# Altium schematic sheet USB-C.SchDoc
size A3; SheetNumber: 4; SheetTotal: 5
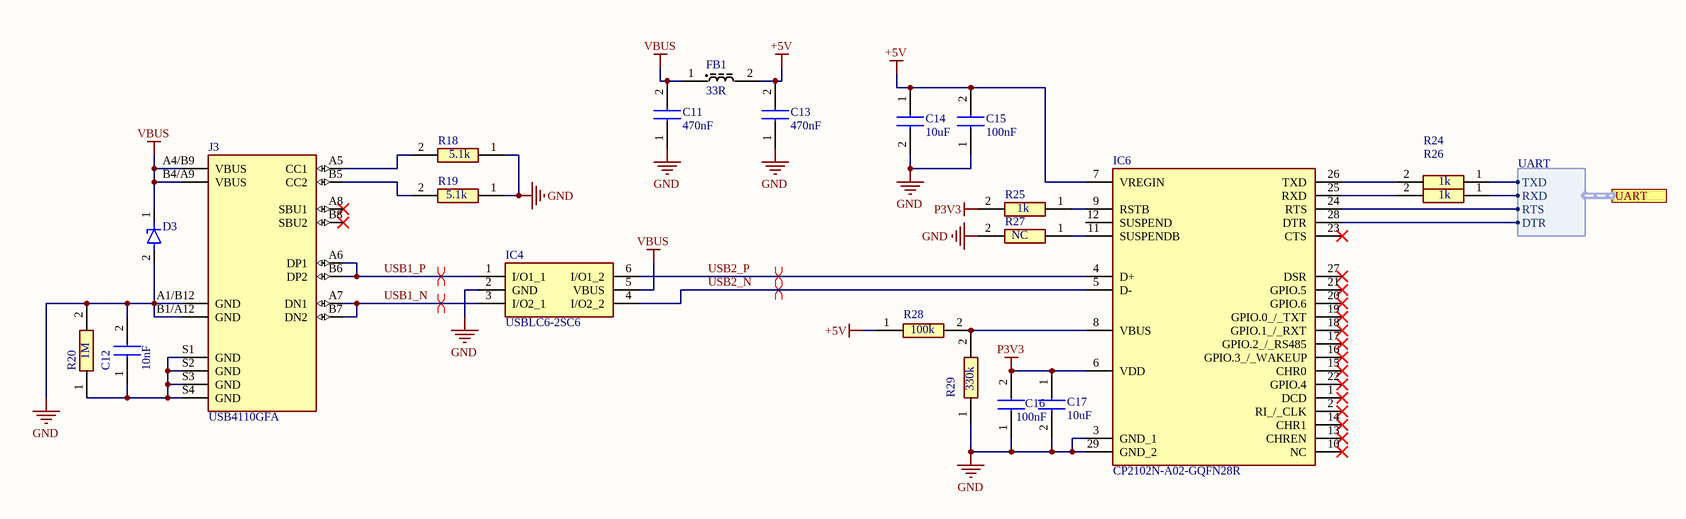
[diagram p0: USB-C.SchDoc]

## Parts
C11  470nF  [GRM15x]
C12  10nF  [GRM15x]
C13  470nF  [GRM15x]
C14  10uF  [GRM18x]
C15  100nF  [CAPC1005X70N]
C16  100nF  [CAPC1005X70N]
C17  10uF  [GRM18x]
D3  ESDA25P35-1U1M  [ESDA25P351U1M]  (value not drawn)
FB1  33R  [BLM18SP221SN1B]
IC4  USBLC6-2SC6  [SOT95P280X145-6N]
IC6  CP2102N-A02-GQFN28R  [QFN50P500X500X80-29N-D]
J3  USB4110GFA  [GCT_USB4110GFA]
R18  5.1k  [RESC1005X35N]
R19  5.1k  [RESC1005X35N]
R20  1M  [RESC1005X40N]
R24  1k  [RESC1005X35N]
R25  1k  [RESC1005X35N]
R26  1k  [RESC1005X35N]
R27  NC  [RESC1005X35N]
R28  100k  [RESC1005X40N]
R29  330k  [RESC1005X40N]

## Ports
UART (harness UART, see main[3B], ESP32C6[3B])

## Harnesses
UART: TXD, RXD, RTS, DTR

## Nets
+5V: C13.2 C14.1 C15.2 FB1.2 IC6.7(VREGIN) R28.1
GND: C11.1 C12.2 C13.1 C14.2 C15.1 C16.1 C17.2 D3.2(A) IC4.2(GND) IC6.3(GND_1) IC6.29(GND_2) J3.A1/B12(GND) J3.B1/A12(GND) R18.1 R19.1 R20.2 R27.2 R29.1
P3V3: C16.2 C17.1 IC6.6(VDD) R25.2
VBUS: C11.2 D3.1(K) FB1.1 IC4.5(VBUS) J3.A4/B9(VBUS) J3.B4/A9(VBUS)
USB1_N: IC4.3(I/O2_1) J3.A7(DN1) J3.B7(DN2)
USB1_P: IC4.1(I/O1_1) J3.A6(DP1) J3.B6(DP2)
USB2_N: IC4.4(I/O2_2) IC6.5(D-)
USB2_P: IC4.6(I/O1_2) IC6.4(D+)
NetC12_1: C12.1 J3.S1(GND) J3.S2(GND) J3.S3(GND) J3.S4(GND) R20.1
NetIC6_8: IC6.8(VBUS) R28.2 R29.2
NetIC6_9: IC6.9(RSTB) R25.1
NetIC6_11: IC6.11(SUSPENDB) R27.1
NetIC6_24: IC6.24(RTS) ; port UART.RTS
NetIC6_25: IC6.25(RXD) R26.2
NetIC6_26: IC6.26(TXD) R24.2
NetIC6_28: IC6.28(DTR) ; port UART.DTR
NetJ3_A5: J3.A5(CC1) R18.2
NetJ3_B5: J3.B5(CC2) R19.2
NetR24_1: R24.1 ; port UART.TXD
NetR26_1: R26.1 ; port UART.RXD

Not connected (* = marked no-connect by the designer): IC6 1(DCD)* 2(RI_/_CLK)* 10(NC)* 12(SUSPEND) 13(CHREN)* 14(CHR1)* 15(CHR0)* 16(GPIO.3_/_WAKEUP)* 17(GPIO.2_/_RS485)* 18(GPIO.1_/_RXT)* 19(GPIO.0_/_TXT)* 20(GPIO.6)* 21(GPIO.5)* 22(GPIO.4)* 23(CTS)* 27(DSR)*; J3 A8(SBU1)* B8(SBU2)*

## Layout directives
differential pair; differential pair class USB; net class USB: USB1_N, USB1_P, USB2_N, USB2_P

## Notes on the sheet
- Title:
- Date:
- Project:
- Type:
- Schematic
- Variant:
- Revision:
- Sheet
- of
- Author:
- Evžen Šteif
- Size:
- A4

## Library data of the parts
C11 C13 = GRM155R61H474KE11J: Capacitor; Manufacturer_Name: Murata Electronics; Datasheet Link: https://search.murata.co.jp/Ceramy/image/img/A01X/G101/ENG/GRM155R61H474KE11-01A.pdf; Height: 0.33mm; Manufacturer_Part_Number: GRM155R61H474KE11J; Mouser Part Number: 81-GRM155R61H474KE1J; Mouser Price/Stock: https://www.mouser.co.uk/ProductDetail/Murata-Electronics/GRM155R61H474KE11J?qs=lEfY3O89AqlWLR2W%252BlOiGQ%3D%3D
C12 = GRM155R71H103KA88D: Capacitor; Manufacturer_Name: Murata Electronics; Datasheet Link: https://search.murata.co.jp/Ceramy/image/img/A01X/G101/ENG/GRM155R71H103KA88-01A.pdf; Height: 0.33mm; Manufacturer_Part_Number: GRM155R71H103KA88D; Mouser Part Number: 81-GRM155R71H103KA8D; Mouser Price/Stock: https://www.mouser.co.uk/ProductDetail/Murata-Electronics/GRM155R71H103KA88D?qs=Dfh4SrgScWxOVlCuzd3ZyQ%3D%3D; Arrow Part Number: GRM155R71H103KA88D; Arrow Price/Stock: https://www.arrow.com/en/products/grm155r71h103ka88d/murata-manufacturing?utm_currency=USD&region=nac
C14 C17 = GRM188R61E106KA73D: Capacitor; Manufacturer_Name: Murata Electronics; Datasheet Link: https://search.murata.co.jp/Ceramy/image/img/A01X/G101/ENG/GRM188R61E106KA73-01A.pdf; Height: 0.9mm; Manufacturer_Part_Number: GRM188R61E106KA73D; Mouser Part Number: 81-GRM188R61E106KA3D; Mouser Price/Stock: https://www.mouser.co.uk/ProductDetail/Murata-Electronics/GRM188R61E106KA73D?qs=5aG0NVq1C4z8ebxPkQZf9A%3D%3D; Arrow Part Number: GRM188R61E106KA73D; Arrow Price/Stock: https://www.arrow.com/en/products/grm188r61e106ka73d/murata-manufacturing?region=nac
C15 C16 = GRM155R61A104KA01D: Capacitor; Manufacturer_Name: Murata Electronics; Datasheet Link: https://search.murata.co.jp/Ceramy/image/img/A01X/G101/ENG/GRM155R61A104KA01-02A.pdf; Height: 0.7mm; Manufacturer_Part_Number: GRM155R61A104KA01D; Mouser Part Number: 81-GRM155R61A104KA01; Mouser Price/Stock: https://www.mouser.co.uk/ProductDetail/Murata-Electronics/GRM155R61A104KA01D?qs=5bAuhL3RhmNZw0v59AqOJA%3D%3D; Arrow Part Number: GRM155R61A104KA01D; Arrow Price/Stock: https://www.arrow.com/en/products/grm155r61a104ka01d/murata-manufacturing?utm_currency=USD&region=europe
D3 = ESDA25P35-1U1M: TVS Diode (Uni-directional); Manufacturer_Name: STMicroelectronics; Datasheet Link: https://www.st.com/resource/en/datasheet/esda25p35-1u1m.pdf; Height: 0.6mm; Manufacturer_Part_Number: ESDA25P35-1U1M; Mouser Part Number: 511-ESDA25P35-1U1M; Mouser Price/Stock: https://www.mouser.co.uk/ProductDetail/STMicroelectronics/ESDA25P35-1U1M?qs=aVyJF2WnouQUWqgNP85ZrA%3D%3D; Arrow Part Number: ESDA25P35-1U1M; Arrow Price/Stock: https://www.arrow.com/en/products/esda25p35-1u1m/stmicroelectronics?utm_currency=USD&region=europe
FB1 = BLM18SG330SN1D: Ferrite Bead; Manufacturer_Name: Murata Electronics; Datasheet Link: http://www.murata.com/~/media/webrenewal/support/library/catalog/products/emc/emifil/c31e.ashx?la=en-gb; Height: 0.95mm; Manufacturer_Part_Number: BLM18SG330SN1D; Mouser Part Number: 81-BLM18SG330SN1D; Mouser Price/Stock: https://www.mouser.co.uk/ProductDetail/Murata-Electronics/BLM18SG330SN1D?qs=7EBvPakHacUT88safgvlfQ%3D%3D; Arrow Part Number: BLM18SG330SN1D; Arrow Price/Stock: https://www.arrow.com/en/products/blm18sg330sn1d/murata-manufacturing
IC4 = USBLC6-2SC6: Integrated Circuit; Manufacturer_Name: STMicroelectronics; Datasheet Link: http://www.st.com/st-web-ui/static/active/en/resource/technical/document/datasheet/CD00050750.pdf; Height: 1.45mm; Manufacturer_Part_Number: USBLC6-2SC6; Mouser Part Number: 511-USBLC6-2SC6; Mouser Price/Stock: https://www.mouser.co.uk/ProductDetail/STMicroelectronics/USBLC6-2SC6?qs=po45yt2pPpu%2FhNIlwQdTlg%3D%3D; Arrow Part Number: USBLC6-2SC6; Arrow Price/Stock: https://www.arrow.com/en/products/usblc6-2sc6/stmicroelectronics?utm_currency=USD&region=europe
IC6 = CP2102N-A02-GQFN28R: Integrated Circuit; Manufacturer_Name: Silicon Labs; Datasheet Link: https://www.silabs.com/documents/public/data-sheets/cp2102n-datasheet.pdf; Height: 0.8mm; Manufacturer_Part_Number: CP2102N-A02-GQFN28R; Mouser Part Number: 634-CP2102NA02QFN28R; Mouser Price/Stock: https://www.mouser.co.uk/ProductDetail/Silicon-Labs/CP2102N-A02-GQFN28R?qs=u16ybLDytRag4qKvSH3fTw%3D%3D; Arrow Part Number: CP2102N-A02-GQFN28R; Arrow Price/Stock: https://www.arrow.com/en/products/cp2102n-a02-gqfn28r/silicon-labs?utm_currency=USD&region=nac
J3 = USB4110GFA: USB-C (USB TYPE-C) USB 2.0 Receptacle Connector 24 (16+8 Dummy) Position Surface Mount, Right Angle; MF: Global Connector Technology; SnapEDA_Link: https://www.snapeda.com/parts/USB4110GFA/Global+Connector+Technology/view-part/?ref=snap; Package: None; Value: *; MP: USB4110GFA; Check_prices: https://www.snapeda.com/parts/USB4110GFA/Global+Connector+Technology/view-part/?ref=eda
R18 R19 = RT0402FRE075K1L: Resistor; Manufacturer_Name: YAGEO; Datasheet Link: https://www.yageo.com/upload/media/product/app/datasheet/rchip/pyu-rt_1-to-0.01_rohs_l.pdf; Height: 0.35mm; Manufacturer_Part_Number: RT0402FRE075K1L; Mouser Part Number: RT0402FRE075K1L; Mouser Price/Stock: https://www.mouser.co.uk/ProductDetail/YAGEO/RT0402FRE07100RL?qs=BXCcY9r%252B08AcvLZjF7vcwQ%3D%3D
R20 = RC0402FR-071ML: Resistor; Manufacturer_Name: YAGEO; Datasheet Link: https://componentsearchengine.com/Datasheets/2/RC0402FR-071ML.pdf; Height: 0.4mm; Manufacturer_Part_Number: RC0402FR-071ML; Mouser Part Number: 603-RC0402FR-071ML; Mouser Price/Stock: https://www.mouser.co.uk/ProductDetail/YAGEO/RC0402FR-071ML?qs=V1yeUXFNrknfoI4987wfBQ%3D%3D; Arrow Part Number: RC0402FR-071ML; Arrow Price/Stock: https://www.arrow.com/en/products/rc0402fr-071ml/yageo?region=nac
R24-R26 = RT0402FRE071KL: Resistor; Manufacturer_Name: KEMET; Datasheet Link: https://www.yageo.com/upload/media/product/productsearch/datasheet/rchip/PYu-RT_1-to-0.01_RoHS_L_11.pdf; Height: 0.35mm; Manufacturer_Part_Number: RT0402FRE071KL; Mouser Part Number: RT0402FRE071KL; Mouser Price/Stock: https://www.mouser.co.uk/ProductDetail/YAGEO/RT0402FRE07100KL?qs=BXCcY9r%252B08CxTvf5JB1kiw%3D%3D; Arrow Part Number: RT0402FRE07100KL; Arrow Price/Stock: https://www.arrow.com/en/products/rt0402fre07100kl/yageo
R27 = RT0402FRE0710KL: Resistor; Manufacturer_Name: KEMET; Datasheet Link: https://cz.mouser.com/datasheet/2/447/PYu_RT_1_to_0_01_RoHS_L_15-3461507.pdf; Height: 0.35mm; Manufacturer_Part_Number: RT0402FRE0710KL; Mouser Part Number: 603-RT0402FRE0710KL; Mouser Price/Stock: https://www.mouser.co.uk/ProductDetail/YAGEO/RT0402FRE07100KL?qs=BXCcY9r%252B08CxTvf5JB1kiw%3D%3D; Arrow Part Number: RT0402FRE07100KL; Arrow Price/Stock: https://www.arrow.com/en/products/rt0402fre07100kl/yageo
R28 = RC0402BR-07100KL: Resistor; Manufacturer_Name: YAGEO; Datasheet Link: https://cz.mouser.com/datasheet/2/447/PYu_RC_Group_51_RoHS_L_12-3368608.pdf; Height: 0.4mm; Manufacturer_Part_Number: RC0402BR-07100KL
R29 = RC0402BR-07330KL: Resistor; Manufacturer_Name: YAGEO; Datasheet Link: https://cz.mouser.com/datasheet/2/447/PYu_RC_Group_51_RoHS_L_11-1984063.pdf; Height: 0.4mm; Manufacturer_Part_Number: RC0402BR-07330KL